# Altium schematic sheet BLE_MCU.SchDoc
size A4
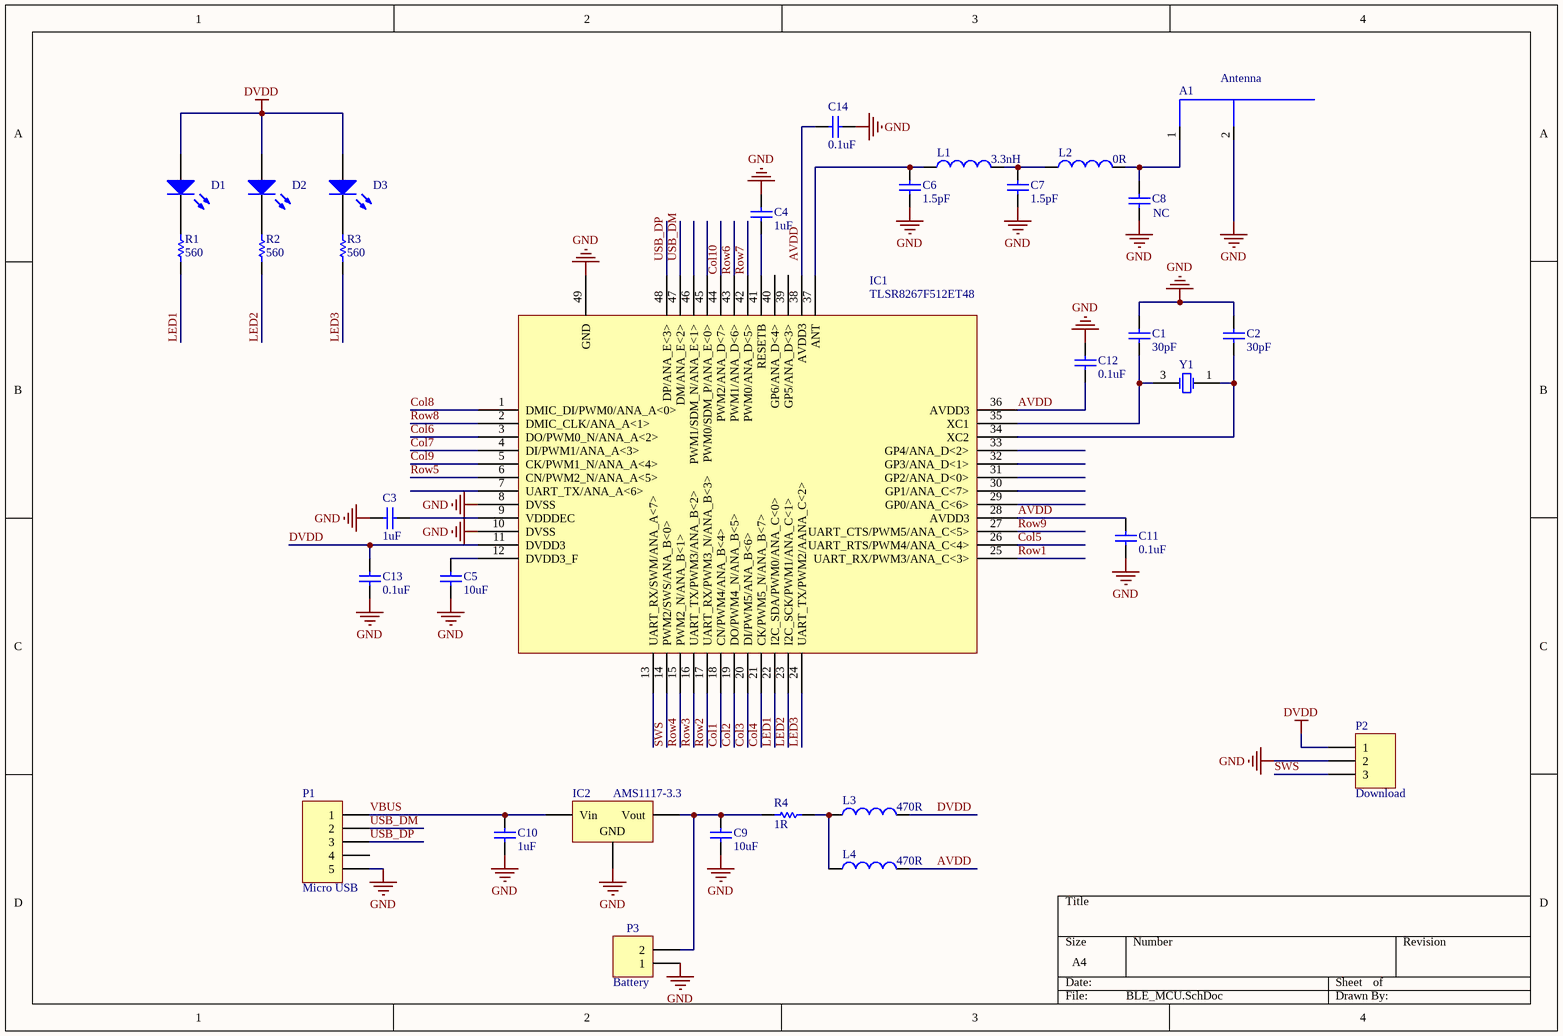
[diagram p0: BLE_MCU.SchDoc]

## Parts
A1  Antenna  [ANT_IFA_TI_DN0007]
C1  value 30pF  [C603_4MOD]  (hidden comment: Cap)
C2  value 30pF  [C603_4MOD]  (hidden comment: Cap)
C3  value 1uF  [C603_4MOD]  (hidden comment: Cap)
C4  value 1uF  [C603_4MOD]  (hidden comment: Cap)
C5  value 10uF  [L0805_POWER_4MOD]  (hidden comment: Cap)
C6  value 1.5pF  [C402_4MOD]  (hidden comment: Cap)
C7  value 1.5pF  [C402_4MOD]  (hidden comment: Cap)
C8  NC  [C402_4MOD]
C9  value 10uF  [L0805_POWER_4MOD]  (hidden comment: Cap)
C10  value 1uF  [C603_4MOD]  (hidden comment: Cap)
C11  value 0.1uF  [C603_4MOD]  (hidden comment: Cap)
C12  value 0.1uF  [C603_4MOD]  (hidden comment: Cap)
C13  value 0.1uF  [C603_4MOD]  (hidden comment: Cap)
C14  value 0.1uF  [C603_4MOD]  (hidden comment: Cap)
D1  LED2  [3.8mm]  (value not drawn)
D2  LED2  [3.8mm]  (value not drawn)
D3  LED2  [3.8mm]  (value not drawn)
IC1  TLSR8267F512ET48  [CC26XX_QFN48(7X7)_0P5]
IC2  AMS1117-3.3  [SOT-223]
L1  value 3.3nH  [L0402_4MOD]  (hidden comment: Inductor)
L2  value 0R  [L0402_4MOD]  (hidden comment: Inductor)
L3  value 470R  [L0805_POWER_4MOD]  (hidden comment: Inductor)
L4  value 470R  [L0805_POWER_4MOD]  (hidden comment: Inductor)
P1  Micro USB  [MICROUSB]
P2  Download  [SWS]
P3  Battery  [HDR1X2]
R1  value 560  [L0805_POWER_4MOD]  (hidden comment: Res1)
R2  value 560  [L0805_POWER_4MOD]  (hidden comment: Res1)
R3  value 560  [L0805_POWER_4MOD]  (hidden comment: Res1)
R4  value 1R  [L0805_POWER_4MOD]  (hidden comment: Res1)
Y1  XTAL  [XTAL_SMD_3225(3.2X2.5)]  (value not drawn)

## Nets
DVDD: C13.1 D1.1(A) D2.1(A) D3.1(A) IC1.11(DVDD3) L3.2 P2.1
GND: A1.2(GND) C1.2 C2.2 C3.2 C4.1 C5.2 C6.2 C7.2 C8.2 C9.2 C10.2 C11.2 C12.1 C13.2 C14.2 IC1.8(DVSS) IC1.10(DVSS) IC1.49(GND) IC2.1(GND) P1.5 P2.2 P3.1
AVDD: C11.1 C12.2 C14.1 IC1.28(AVDD3) IC1.36(AVDD3) IC1.38(AVDD3) L4.2
Col1: IC1.18(CN/PWM4/ANA_B<4>)
Col2: IC1.19(DO/PWM4_N/ANA_B<5>)
Col3: IC1.20(DI/PWM5/ANA_B<6>)
Col4: IC1.21(CK/PWM5_N/ANA_B<7>)
Col5: IC1.26(UART_RTS/PWM4/ANA_C<4>)
Col6: IC1.3(DO/PWM0_N/ANA_A<2>)
Col7: IC1.4(DI/PWM1/ANA_A<3>)
Col8: IC1.1(DMIC_DI/PWM0/ANA_A<0>)
Col9: IC1.5(CK/PWM1_N/ANA_A<4>)
Col10: IC1.44(PWM2/ANA_D<7>)
LED1: IC1.22(I2C_SDA/PWM0/ANA_C<0>) R1.1
LED2: IC1.23(I2C_SCK/PWM1/ANA_C<1>) R2.1
LED3: IC1.24(UART_TX/PWM2/AANA_C<2>) R3.1
Row1: IC1.25(UART_RX/PWM3/ANA_C<3>)
Row2: IC1.17(UART_RX/PWM3_N/ANA_B<3>)
Row3: IC1.16(UART_TX/PWM3/ANA_B<2>)
Row4: IC1.15(PWM2_N/ANA_B<1>)
Row5: IC1.6(CN/PWM2_N/ANA_A<5>)
Row6: IC1.43(PWM1/ANA_D<6>)
Row7: IC1.42(PWM0/ANA_D<5>)
Row8: IC1.2(DMIC_CLK/ANA_A<1>)
Row9: IC1.27(UART_CTS/PWM5/ANA_C<5>)
SWS: IC1.14(PWM2/SWS/ANA_B<0>) P2.3
USB_DM: IC1.47(DM/ANA_E<2>) P1.2
USB_DP: IC1.48(DP/ANA_E<3>) P1.3
VBUS: C10.1 IC2.3(Vin) P1.1
NetA1_1: A1.1(Antenna) C8.1 L2.2
NetC1_1: C1.1 IC1.35(XC1) Y1.3(OSC2)
NetC2_1: C2.1 IC1.34(XC2) Y1.1(OSC1)
NetC3_1: C3.1 IC1.9(VDDDEC)
NetC4_2: C4.2 IC1.41(RESETB)
NetC5_1: C5.1 IC1.12(DVDD3_F)
NetC6_1: C6.1 IC1.37(ANT) L1.1
NetC7_1: C7.1 L1.2 L2.1
NetC9_1: C9.1 IC2.2(Vout) P3.2 R4.2
NetD1_2: D1.2(K) R1.2
NetD2_2: D2.2(K) R2.2
NetD3_2: D3.2(K) R3.2
NetL3_1: L3.1 L4.1 R4.1

Not connected (* = marked no-connect by the designer): IC1 7(UART_TX/ANA_A<6>) 13(UART_RX/SWM/ANA_A<7>) 29(GP0/ANA_C<6>) 30(GP1/ANA_C<7>) 31(GP2/ANA_D<0>) 32(GP3/ANA_D<1>) 33(GP4/ANA_D<2>) 39(GP5/ANA_D<3>) 40(GP6/ANA_D<4>) 45(PWM0/SDM_P/ANA_E<0>) 46(PWM1/SDM_N/ANA_E<1>); P1 4

## Library data of the parts
C1-C7 C9-C14 = Cap: Capacitor; Published: 8-Jun-2000; LatestRevisionDate: 17-Jul-2002; LatestRevisionNote: Re-released for DXP Platform.; PackageReference: RAD-0.3; Publisher: Altium Limited; PackageDescription: Radial Cap, Thru-Hole; 2 Leads; 0.3 in Pin Spacing
C8 = Cap: Capacitor; Value: 1.5pF; Published: 8-Jun-2000; LatestRevisionDate: 17-Jul-2002; LatestRevisionNote: Re-released for DXP Platform.; PackageReference: RAD-0.3; Publisher: Altium Limited; PackageDescription: Radial Cap, Thru-Hole; 2 Leads; 0.3 in Pin Spacing
D1-D3 = LED2: Typical RED, GREEN, YELLOW, AMBER GaAs LED; Published: 8-Jun-2000; LatestRevisionDate: 17-Jul-2002; LatestRevisionNote: Re-released for DXP Platform.; PackageVersion: Feb-2002; PackageReference: 3.2X1.6X1.1; Publisher: Altium Limited; PackageDescription: SM LED; 2 Flat Leads
IC2 = Volt Reg: Voltage Regulator; Published: 24-Mar-1999; LatestRevisionDate: 29-May-2009; LatestRevisionNote: IPC-7351 Footprint Added.; PackageReference: D2PAK; Publisher: Altium Limited; PackageDescription: 3-Pin Transistor Outline Package 2.54 mm Pitch, 15.1 mm Lead Span
L1-L4 = Inductor: Code_IEC: 1005; Published: 8-Jun-2000; LatestRevisionDate: 29-May-2009; LatestRevisionNote: IPC-7351 Footprint Added.; PackageReference: 0402-A; Publisher: Altium Limited; PackageDescription: Chip Inductor; Code_JEITA: 0402
P1 = MHDR1X5: Header, 5-Pin; LatestRevisionDate: 17-Jul-2002; LatestRevisionNote: Re-released for DXP Platform.; Publisher: Altium Limited
P2 = Header 3: Header, 3-Pin; LatestRevisionDate: 17-Jul-2002; LatestRevisionNote: Re-released for DXP Platform.; Publisher: Altium Limited
P3 = Header 2: Header, 2-Pin; LatestRevisionDate: 17-Jul-2002; LatestRevisionNote: Re-released for DXP Platform.; Publisher: Altium Limited
R1-R4 = Res1: Resistor; Published: 8-Jun-2000; LatestRevisionDate: 17-Jul-2002; LatestRevisionNote: Re-released for DXP Platform.; PackageReference: AXIAL-0.3; Publisher: Altium Limited; PackageDescription: Axial Device, Thru-Hole; 2 Leads; 0.3 in Pin Spacing
Y1 = XTAL: Crystal Oscillator; Published: 8-Jun-2000; LatestRevisionDate: 17-Jul-2002; LatestRevisionNote: Re-released for DXP Platform.; PackageReference: R38; Publisher: Altium Limited; PackageDescription: Crystal, Thru-Hole; 2 Leads; Body 3.1 x 8.2 mm (Dia.xH)